# Altium schematic sheet Sheet1.SchDoc
size A4; SheetNumber: 1; SheetTotal: 2
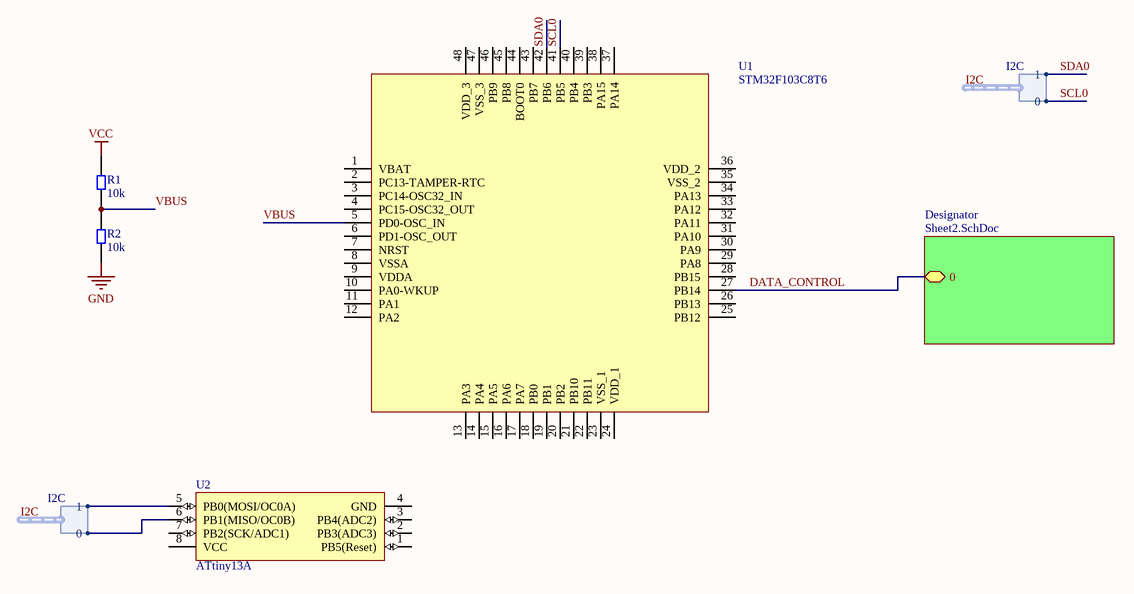
[diagram p0: Sheet1.SchDoc]

## Parts
R1  10k  [RES_0805]
R2  10k  [RES_0805]
U1  STM32F103C8T6  [TQFP48]
U2  ATtiny13A  [DIP 8]

## Sub-sheets
Designator = Sheet2.SchDoc: 0 (bidir)

## Harnesses
I2C: 0, 1

## Nets
GND: R2.2
VCC: R1.1
DATA_CONTROL: U1.27(PB14) ; sheet Designator/0
SCL0: U1.41(PB5) U2.6(PB1(MISO/OC0B)) ; harness I2C.0  [project net I2C.0]
SDA0: U1.42(PB6) U2.5(PB0(MOSI/OC0A)) ; harness I2C.1  [project net I2C.1]
VBUS: R1.2 R2.1 U1.5(PD0-OSC_IN)

Not connected (* = marked no-connect by the designer): U1 1(VBAT) 2(PC13-TAMPER-RTC) 3(PC14-OSC32_IN) 4(PC15-OSC32_OUT) 6(PD1-OSC_OUT) 7(NRST) 8(VSSA) 9(VDDA) 10(PA0-WKUP) 11(PA1) 12(PA2) 13(PA3) 14(PA4) 15(PA5) 16(PA6) 17(PA7) 18(PB0) 19(PB1) 20(PB2) 21(PB10) 22(PB11) 23(VSS_1) 24(VDD_1) 25(PB12) 26(PB13) 28(PB15) 29(PA8) 30(PA9) 31(PA10) 32(PA11) 33(PA12) 34(PA13) 35(VSS_2) 36(VDD_2) 37(PA14) 38(PA15) 39(PB3) 40(PB4) 43(PB7) 44(BOOT0) 45(PB8) 46(PB9) 47(VSS_3) 48(VDD_3); U2 1(PB5(Reset)) 2(PB3(ADC3)) 3(PB4(ADC2)) 4(GND) 7(PB2(SCK/ADC1)) 8(VCC)

## Library data of the parts
R1 R2 = Resistor
U1 = STM32F103C8T6: ARM-based 32-bit MCU with 64 or 128 KB Flash, USB, CAN, 7 timers, 2 ADCs, 9 com. interfaces; STM32CubeImport: Cube/filename.txt
U2 = ATtiny13A: 8-PDIP/SOIC